# EAGLE design 3P4W_v1p3 (EAGLE 9.6.2)
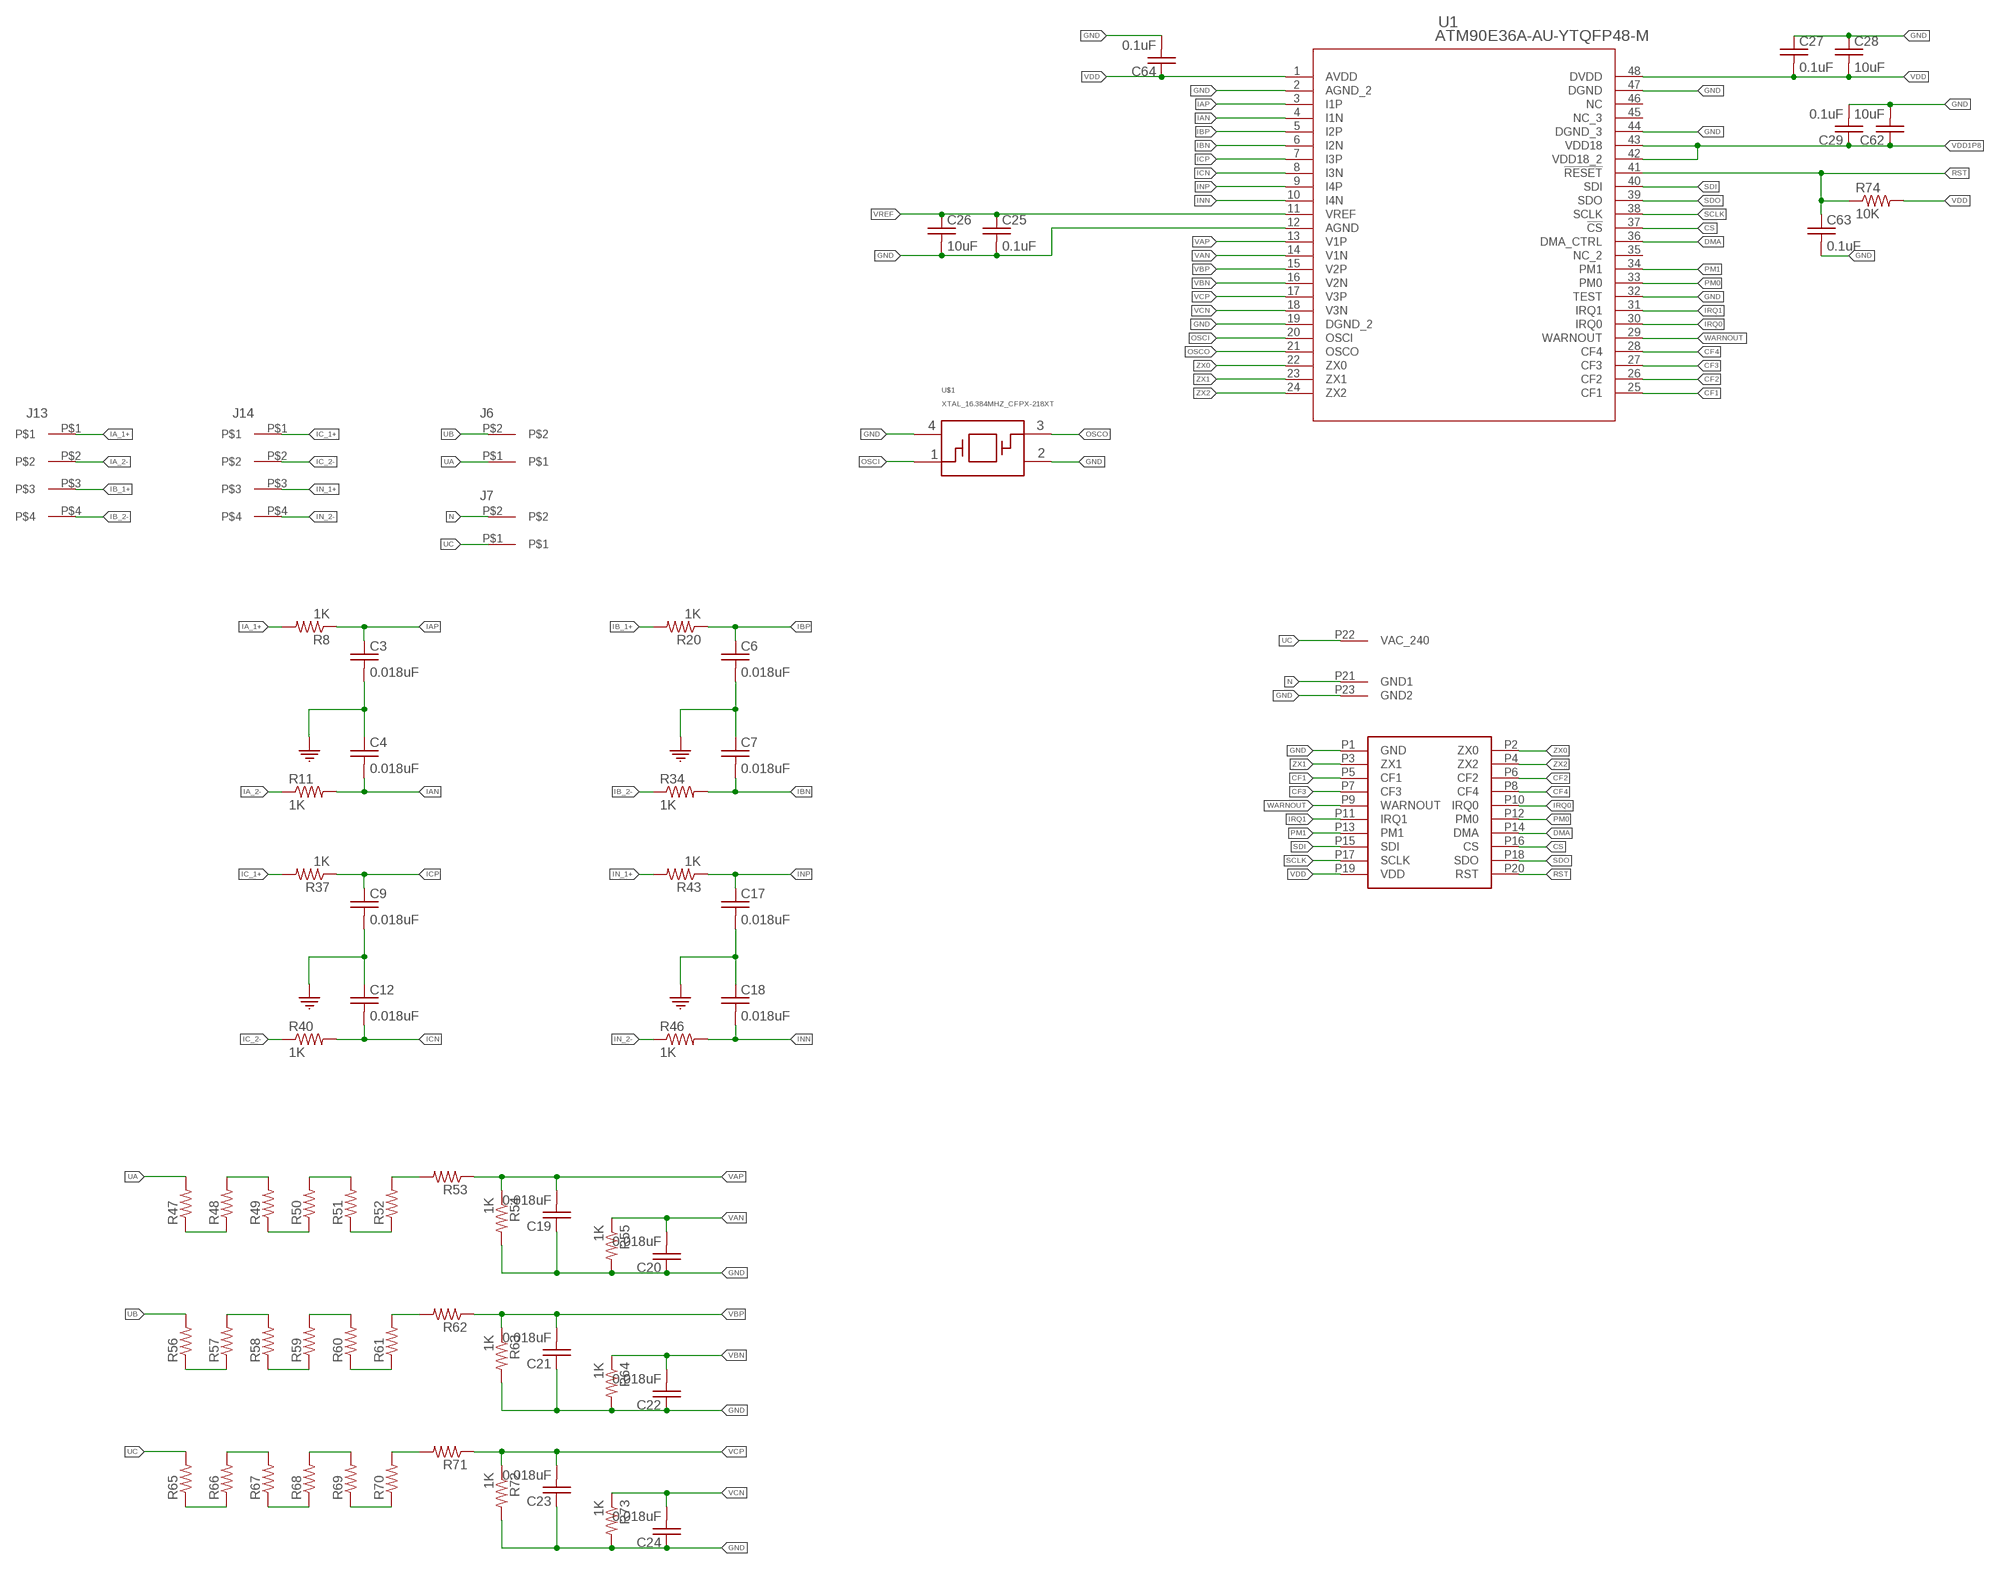
[diagram p0: schematic, sheet 1]

## Parts
C3  0.018uF  C_0402  [0402]
C4  0.018uF  C_0402  [0402]
C6  0.018uF  C_0402  [0402]
C7  0.018uF  C_0402  [0402]
C9  0.018uF  C_0402  [0402]
C12  0.018uF  C_0402  [0402]
C17  0.018uF  C_0402  [0402]
C18  0.018uF  C_0402  [0402]
C19  0.018uF  C_0402  [0402]
C20  0.018uF  C_0402  [0402]
C21  0.018uF  C_0402  [0402]
C22  0.018uF  C_0402  [0402]
C23  0.018uF  C_0402  [0402]
C24  0.018uF  C_0402  [0402]
C25  0.1uF  C_0402  [0402]
C26  10uF  C_0402  [0402]
C27  0.1uF  C_0402  [0402]
C28  10uF  C_0402  [0402]
C29  0.1uF  C_0402  [0402]
C62  10uF  C_0402  [0402]
C63  0.1uF  C_0402  [0402]
C64  0.1uF  C_0402  [0402]
J6  3.81MM_1_X_2_RT_ANGLE_PLUG_HEADER  [2_3.81MM_PITCH]
J7  3.81MM_1_X_2_RT_ANGLE_PLUG_HEADER  [2_3.81MM_PITCH]
J13  3.81MM_1_X_4_RT_ANGLE_PLUG_HEADER  [1X4_3.81MM_PITCH]
J14  3.81MM_1_X_4_RT_ANGLE_PLUG_HEADER  [1X4_3.81MM_PITCH]
R8  1K  R_0402  [0402]
R11  1K  R_0402  [0402]
R20  1K  R_0402  [0402]
R34  1K  R_0402  [0402]
R37  1K  R_0402  [0402]
R40  1K  R_0402  [0402]
R43  1K  R_0402  [0402]
R46  1K  R_0402  [0402]
R47  R_0402  [0402]
R48  R_0402  [0402]
R49  R_0402  [0402]
R50  R_0402  [0402]
R51  R_0402  [0402]
R52  R_0402  [0402]
R53  R_0402  [0402]
R54  1K  R_0402  [0402]
R55  1K  R_0402  [0402]
R56  R_0402  [0402]
R57  R_0402  [0402]
R58  R_0402  [0402]
R59  R_0402  [0402]
R60  R_0402  [0402]
R61  R_0402  [0402]
R62  R_0402  [0402]
R63  1K  R_0402  [0402]
R64  1K  R_0402  [0402]
R65  R_0402  [0402]
R66  R_0402  [0402]
R67  R_0402  [0402]
R68  R_0402  [0402]
R69  R_0402  [0402]
R70  R_0402  [0402]
R71  R_0402  [0402]
R72  1K  R_0402  [0402]
R73  1K  R_0402  [0402]
R74  10K  R_0402  [0402]
U1  ATM90E36A-AU-YTQFP48-M  [TQFP48-M]
U$1  XTAL_16.384MHZ_CFPX-218XT  [XTAL_2.5X2.0]
U$2  METER_BASE  [METER_BASE]

## Nets
CF1: U1.25(CF1) U$2.P5(CF1)
CF2: U1.26(CF2) U$2.P6(CF2)
CF3: U1.27(CF3) U$2.P7(CF3)
CF4: U1.28(CF4) U$2.P8(CF4)
CS: U1.37(!CS) U$2.P16(CS)
DMA: U1.36(DMA_CTRL) U$2.P14(DMA)
GND: C3.P$2 C4.P$1 C6.P$2 C7.P$1 C9.P$2 C12.P$1 C17.P$2 C18.P$1 C19.P$1 C20.P$1 C21.P$1 C22.P$1 C23.P$1 C24.P$1 C25.P$2 C26.P$2 C27.P$1 C28.P$1 C29.P$2 C62.P$2 C63.P$2 C64.P$2 R54.P$2 R55.P$2 R63.P$2 R64.P$2 R72.P$2 R73.P$2 U1.2(AGND_2) U1.12(AGND) U1.19(DGND_2) U1.32(TEST) U1.44(DGND_3) U1.47(DGND) U$1.2 U$1.4 U$2.P1(GND) U$2.P23(GND2)
IA_1+: J13.P$1 R8.P$2
IA_2-: J13.P$2 R11.P$1
IAN: C4.P$2 R11.P$2 U1.4(I1N)
IAP: C3.P$1 R8.P$1 U1.3(I1P)
IB_1+: J13.P$3 R20.P$2
IB_2-: J13.P$4 R34.P$1
IBN: C7.P$2 R34.P$2 U1.6(I2N)
IBP: C6.P$1 R20.P$1 U1.5(I2P)
IC_1+: J14.P$1 R37.P$2
IC_2-: J14.P$2 R40.P$1
ICN: C12.P$2 R40.P$2 U1.8(I3N)
ICP: C9.P$1 R37.P$1 U1.7(I3P)
IN_1+: J14.P$3 R43.P$2
IN_2-: J14.P$4 R46.P$1
INN: C18.P$2 R46.P$2 U1.10(I4N)
INP: C17.P$1 R43.P$1 U1.9(I4P)
IRQ0: U1.30(IRQ0) U$2.P10(IRQ0)
IRQ1: U1.31(IRQ1) U$2.P11(IRQ1)
N: J7.P$2 U$2.P21(GND1)
N$16: R56.P$1 R57.P$1
N$17: R47.P$1 R48.P$1
N$18: R48.P$2 R49.P$2
N$19: R49.P$1 R50.P$1
N$20: R50.P$2 R51.P$2
N$21: R51.P$1 R52.P$1
N$22: R52.P$2 R53.P$2
N$23: R57.P$2 R58.P$2
N$24: R58.P$1 R59.P$1
N$25: R59.P$2 R60.P$2
N$26: R60.P$1 R61.P$1
N$27: R61.P$2 R62.P$2
N$28: R65.P$1 R66.P$1
N$29: R66.P$2 R67.P$2
N$30: R67.P$1 R68.P$1
N$31: R68.P$2 R69.P$2
N$32: R69.P$1 R70.P$1
N$33: R70.P$2 R71.P$2
OSCI: U1.20(OSCI) U$1.1
OSCO: U1.21(OSCO) U$1.3
PM0: U1.33(PM0) U$2.P12(PM0)
PM1: U1.34(PM1) U$2.P13(PM1)
RST: C63.P$1 R74.P$1 U1.41(!RESET) U$2.P20(RST)
SCLK: U1.38(SCLK) U$2.P17(SCLK)
SDI: U1.40(SDI) U$2.P15(SDI)
SDO: U1.39(SDO) U$2.P18(SDO)
UA: J6.P$1 R47.P$2
UB: J6.P$2 R56.P$2
UC: J7.P$1 R65.P$2 U$2.P22(VAC_240)
VAN: C20.P$2 R55.P$1 U1.14(V1N)
VAP: C19.P$2 R53.P$1 R54.P$1 U1.13(V1P)
VBN: C22.P$2 R64.P$1 U1.16(V2N)
VBP: C21.P$2 R62.P$1 R63.P$1 U1.15(V2P)
VCN: C24.P$2 R73.P$1 U1.18(V3N)
VCP: C23.P$2 R71.P$1 R72.P$1 U1.17(V3P)
VDD: C27.P$2 C28.P$2 C64.P$1 R74.P$2 U1.1(AVDD) U1.48(DVDD) U$2.P19(VDD)
VDD1P8: C29.P$1 C62.P$1 U1.42(VDD18_2) U1.43(VDD18)
VREF: C25.P$1 C26.P$1 U1.11(VREF)
WARNOUT: U1.29(WARNOUT) U$2.P9(WARNOUT)
ZX0: U1.22(ZX0) U$2.P2(ZX0)
ZX1: U1.23(ZX1) U$2.P3(ZX1)
ZX2: U1.24(ZX2) U$2.P4(ZX2)
Unconnected: U1.35(NC_2) U1.45(NC_3) U1.46(NC)

## Library data of the parts
C3 C4 C6 C7 C9 C12 C17-C29 C62-C64 = 3D_MIG_Controller:C_0402
J6 J7 = 3D_MIG_Controller:3.81MM_1_X_2_RT_ANGLE_PLUG_HEADER
J13 J14 = 3D_MIG_Controller:3.81MM_1_X_4_RT_ANGLE_PLUG_HEADER
R8 R11 R20 R34 R37 R40 R43 R46-R74 = 3D_MIG_Controller:R_0402
U1 = 3D_MIG_Controller:ATM90E36A-AU-Y; MANUFACTURER_PART_NUMBER: ATM90E36AAUY; VENDOR: Atmel
U$1 = 3D_MIG_Controller:XTAL_16.384MHZ_CFPX-218
U$2 = 3D_MIG_Controller:METER_BASE

## Board
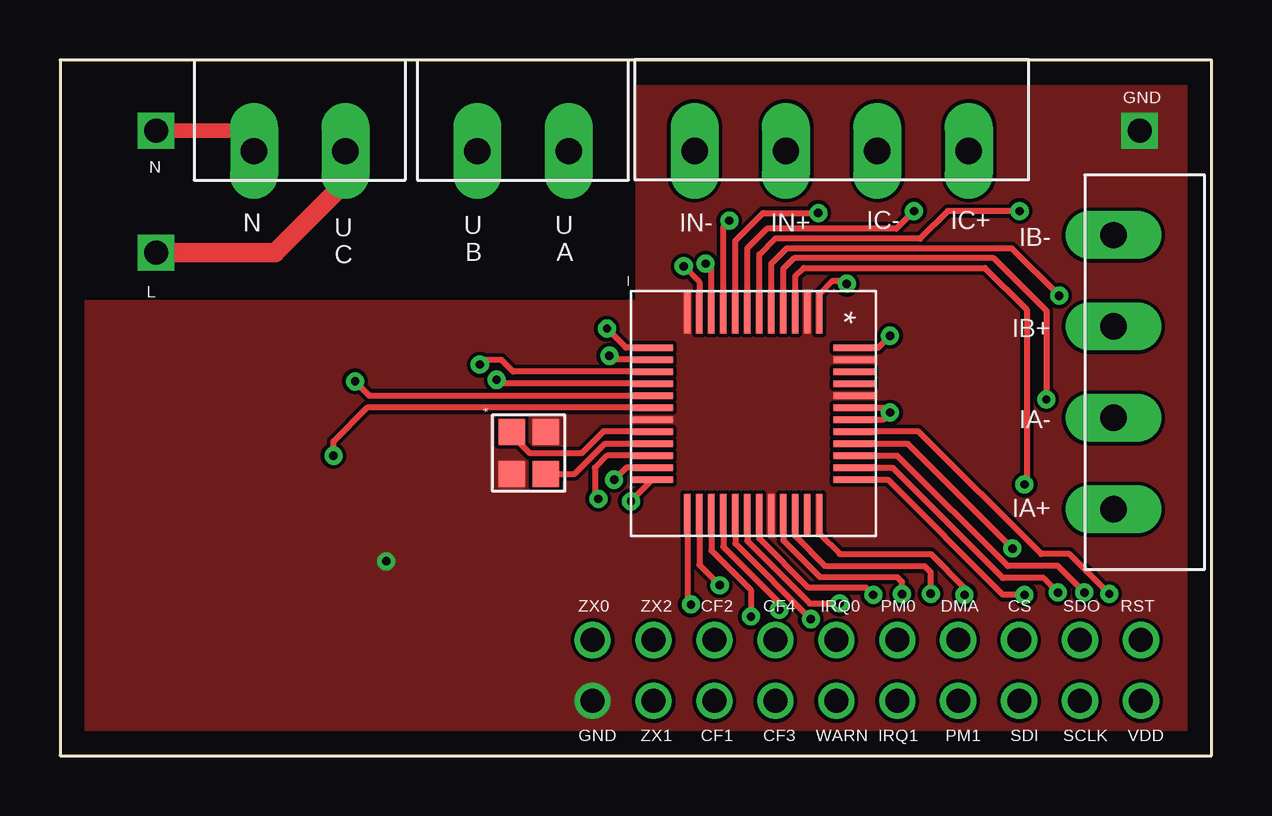
[diagram p1: board, top side]
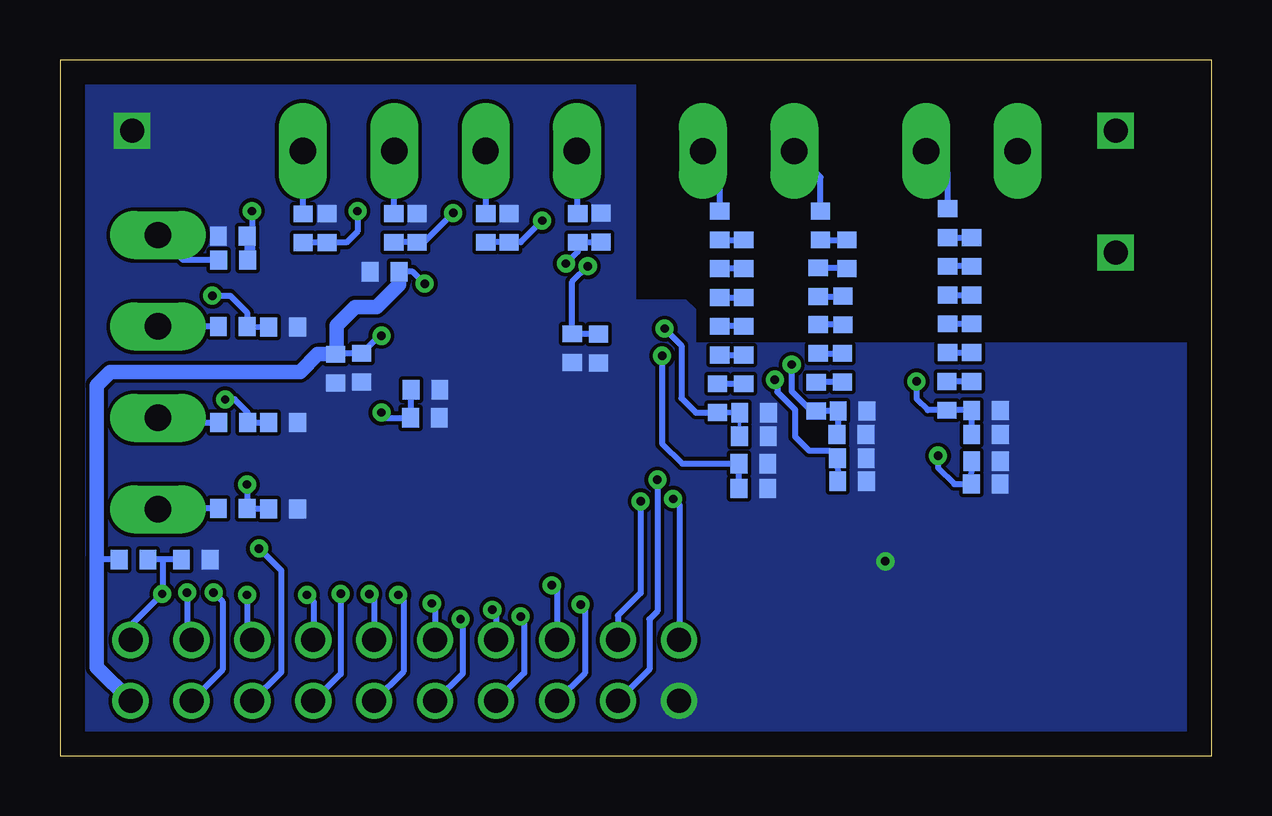
[diagram p2: board, bottom side, seen from below]

Size 48 x 29 mm. Coordinates in mm from the lower left corner, seen from the top.
Outline: 0,0 0,29 48,29 48,0 0,0
Copper layers (1*16): Top 0.035mm / dielectric 1.5mm / Bottom 0.035mm
Design rules "default": minimum track width 6mil, minimum drill 0.35mm, track to track 6mil, track to pad 6mil, pad to pad 6mil, via to via 6mil, smd to smd 6mil, copper to edge 40mil, drill to drill 6mil, minimum pad ring 10mil, minimum via ring 8mil, stop-mask expansion 4mil, vias tented up to drill 0mil, thermal gap 10mil

### Footprints (pad centres in the part's own frame; a part is rotated, then mirrored left to right if it is on the bottom)
0402 = smd 0.8 x 0.7: P$1 0,0.6; P$2 0,-0.6
2_3.81MM_PITCH = drill 1.1 pad 2 long: P$1 0,0; P$2 3.81,0
1X4_3.81MM_PITCH = drill 1.1 pad 2 long: P$1 0,0; P$2 3.81,0; P$3 7.62,0; P$4 11.43,0
TQFP48-M = smd 1.716 x 0.27: 1 -4.201,2.75; 2 -4.201,2.25; 3 -4.201,1.75; 4 -4.201,1.25; 5 -4.201,0.75; 6 -4.201,0.25; 7 -4.201,-0.25; 8 -4.201,-0.75; 9 -4.201,-1.25; 10 -4.201,-1.75; 11 -4.201,-2.25; 12 -4.201,-2.75; 25 4.201,-2.75; 26 4.201,-2.25; 27 4.201,-1.75; 28 4.201,-1.25; 29 4.201,-0.75; 30 4.201,-0.25; 31 4.201,0.25; 32 4.201,0.75; 33 4.201,1.25; 34 4.201,1.75; 35 4.201,2.25; 36 4.201,2.75 | smd 0.27 x 1.716: 13 -2.75,-4.201; 14 -2.25,-4.201; 15 -1.75,-4.201; 16 -1.25,-4.201; 17 -0.75,-4.201; 18 -0.25,-4.201; 19 0.25,-4.201; 20 0.75,-4.201; 21 1.25,-4.201; 22 1.75,-4.201; 23 2.25,-4.201; 24 2.75,-4.201; 37 2.75,4.201; 38 2.25,4.201; 39 1.75,4.201; 40 1.25,4.201; 41 0.75,4.201; 42 0.25,4.201; 43 -0.25,4.201; 44 -0.75,4.201; 45 -1.25,4.201; 46 -1.75,4.201; 47 -2.25,4.201; 48 -2.75,4.201
XTAL_2.5X2.0 = smd 1.1 x 1.1: 1 -0.875,-0.713; 2 0.875,-0.713; 3 0.875,0.713; 4 -0.875,0.713
METER_BASE = drill 1: P1 22.2,2.276; P2 22.2,4.816; P3 24.74,2.276; P4 24.74,4.816; P5 27.28,2.276; P6 27.28,4.816; P7 29.82,2.276; P8 29.82,4.816; P9 32.36,2.276; P10 32.36,4.816; P11 34.9,2.276; P12 34.9,4.816; P13 37.44,2.276; P14 37.44,4.816; P15 39.98,2.276; P16 39.98,4.816; P17 42.52,2.276; P18 42.52,4.816; P19 45.06,2.276; P20 45.06,4.816 | drill 1 square: P21 4,26.046; P22 4,20.966; P23 45,26.046

### Placement (x,y rotation side)
C3  38.7,10.28 90 bottom
C4  38.7,13.89 270 bottom
C6  38.7,17.87 90 bottom
C7  40.8,21.66 90 bottom
C9  36.86,21.99 180 bottom
C12  33.12,22 0 bottom
C17  29.28,22 180 bottom
C18  25.45,22.01 0 bottom
C19  19.08,13.31 270 bottom
C20  19.1,11.13 270 bottom
C21  14.96,14.37 270 bottom
C22  15,12.4 270 bottom
C23  9.4,13.38 270 bottom
C24  9.4,12.27 270 bottom
C25  25.55,16.97 0 bottom
C26  26.65,16.98 0 bottom
C27  34.47,20.17 90 bottom
C28  36.51,16.13 180 bottom
C29  32.79,14.08 90 bottom
C62  32.77,15.25 90 bottom
C63  42.34,8.17 90 bottom
C64  35.43,16.17 0 bottom
J6  21.2,25.2 180 top
J7  11.9,25.2 180 top
J13  43.91,10.27 90 top
J14  37.88,25.21 180 top
R8  40.8,10.3 270 bottom
R11  40.78,13.88 90 bottom
R20  40.8,17.89 270 bottom
R34  40.78,20.66 90 bottom
R37  37.86,21.98 180 bottom
R40  34.08,22 0 bottom
R43  30.25,22 180 bottom
R46  26.42,22 0 bottom
R47  20.5,22.1 180 bottom
R48  19.5,20.9 0 bottom
R49  20.5,19.7 180 bottom
R50  19.5,18.5 0 bottom
R51  20.5,17.3 180 bottom
R52  19.5,16.1 0 bottom
R53  20.6,14.9 180 bottom
R54  19.07,14.29 90 bottom
R55  19.1,12.17 90 bottom
R56  16.3,22.1 180 bottom
R57  15.2,20.9 0 bottom
R58  16.4,19.73 180 bottom
R59  15.36,18.56 0 bottom
R60  16.4,17.37 180 bottom
R61  15.39,16.17 0 bottom
R62  16.48,14.96 180 bottom
R63  15.01,13.39 90 bottom
R64  14.98,11.44 90 bottom
R65  11,22.2 180 bottom
R66  10,21 0 bottom
R67  11,19.8 180 bottom
R68  10,18.6 0 bottom
R69  11,17.4 180 bottom
R70  10,16.2 0 bottom
R71  11.03,15 180 bottom
R72  9.4,14.39 90 bottom
R73  9.41,11.32 90 bottom
R74  44.93,8.17 270 bottom
U1  28.9,14.26 270 top
U$1  19.54,12.62 270 top
U$2  0,0 0 top

### Tracks (layer width: path | path; a pad name or v marks a point on that pad's centre or on a via)
CF1  (via drill 0.35)
  Top 0.254: U1.25 26.15,6.45 v26.3,6.3
  Bottom 0.254: U$2.P5 26.12,3.44 26.12,6.12 v26.3,6.3
CF2  (via drill 0.35)
  Top 0.254: U1.26 26.65,7.95 v27.5,7.1
  Bottom 0.254: v27.5,7.1 27.28,6.88 U$2.P6
CF3  (via drill 0.35)
  Top 0.254: U1.27 27.15,8.55 28.8,6.9 v28.8,5.8
  Bottom 0.254: v28.8,5.8 28.65,5.65 28.65,3.45 U$2.P7
CF4  (via drill 0.35)
  Top 0.254: U1.28 27.65,8.71 29.98,6.38 v29.98,6.08
  Bottom 0.254: v29.98,6.08 29.82,5.92 U$2.P8
CS  (via drill 0.35)
  Top 0.254: U1.37 34.5,11.51 39.31,6.7 v40.2,6.7
  Bottom 0.254: v40.2,6.7 40.2,4.82 U$2.P16
DMA  (via drill 0.35)
  Top 0.254: U1.36 31.65,9.25 32.5,8.4 36.3,8.4 37.7,7 v37.7,6.7
  Bottom 0.254: U$2.P14 37.43,6.43 v37.7,6.7
GND  (via drill 0.35)
  other vias: 13.6,8.1
  pour Bottom (no thermals): 0,17.2 21.5,17.2 21.5,18.6 21.9,19 24,19 24,29 48,29 48,0 0,0
  pour Top (no thermals): 0,19 24.01,19 24.01,29 48,29 48,0 0,0
IA_1+
  Bottom 0.254: R8.P$2 43.88,10.3 J13.P$1
IA_2-
  Bottom 0.254: J13.P$2 43.71,13.88 R11.P$1
IAN  (via drill 0.35)
  Top 0.254: U1.4 30.15,20.3 30.59,20.74 38.92,20.74 41.12,18.55 v41.12,14.85
  Bottom 0.254: v41.12,14.85 40.72,14.85 40.18,14.31 R11.P$2 39.5,13.88 39.49,13.89 C4.P$2
IAP  (via drill 0.35)
  Top 0.254: U1.3 30.65,19.98 31,20.33 38.55,20.33 40.3,18.59 40.3,11.4 v40.2,11.3
  Bottom 0.254: v40.2,11.3 R8.P$1 40.17,10.28 C3.P$1
IB_1+
  Bottom 0.254: R20.P$2 J13.P$3
IB_2-
  Bottom 0.254: R34.P$1 42.87,20.66 J13.P$4
IBN  (via drill 0.35)
  Top 0.254: U1.6 29.15,20.89 29.81,21.55 35.85,21.55 37,22.7 v40,22.7
  Bottom 0.254: v40,22.7 40,20.84 R34.P$2 40.18,21.64 C7.P$2
IBP  (via drill 0.35)
  Top 0.254: U1.5 29.65,20.51 30.28,21.14 39.68,21.14 v41.65,19.17
  Bottom 0.254: v41.65,19.17 40.9,19.17 40.2,18.47 R20.P$1 C6.P$1
IC_1+
  Bottom 0.254: R37.P$2 37.86,25.19 J14.P$1
IC_2-
  Bottom 0.254: R40.P$1 J14.P$2
ICN  (via drill 0.35)
  Top 0.254: U1.8 28.15,21.46 29.31,22.62 v31.61,22.62
  Bottom 0.254: v31.61,22.62 32.83,21.4 C12.P$2 R40.P$2
ICP  (via drill 0.35)
  Top 0.254: U1.7 28.65,21.15 29.46,21.96 34.86,21.96 v35.6,22.7
  Bottom 0.254: v35.6,22.7 35.6,21.85 36.06,21.39 C9.P$1 R37.P$1
IN_1+
  Bottom 0.254: R43.P$2 J14.P$3
IN_2-
  Bottom 0.254: R46.P$1 26.42,25.18 J14.P$4
INN  (via drill 0.35)
  Top 0.254: U1.10 27.15,20.27 v26.91,20.51
  Bottom 0.254: v26.91,20.51 v26.91,20.52 26.42,21.01 R46.P$2 C18.P$2
INP  (via drill 0.35)
  Top 0.254: U1.9 27.65,22.05 v27.9,22.3
  Bottom 0.254: v27.9,22.3 28.8,21.4 C17.P$1 R43.P$1
IRQ0  (via drill 0.35)
  Top 0.254: U1.30 28.65,8.95 31.26,6.34 v32.5,6.34
  Bottom 0.254: v32.5,6.34 32.36,6.2 U$2.P10
IRQ1  (via drill 0.35)
  Top 0.254: v33.9,6.7 33.6,7 31.2,7 29.15,9.05 U1.31
  Bottom 0.254: U$2.P11 33.68,3.5 33.68,6.48 v33.9,6.7
N
  Top 0.61: J7.P$2 7.24,26.05 U$2.P21
N$16
  Bottom 0.254: R56.P$1 R57.P$1
N$17
  Bottom 0.254: R47.P$1 R48.P$1
N$18
  Bottom 0.254: R48.P$2 R49.P$2
N$19
  Bottom 0.254: R49.P$1 R50.P$1
N$20
  Bottom 0.254: R50.P$2 R51.P$2
N$21
  Bottom 0.254: R51.P$1 R52.P$1
N$22
  Bottom 0.254: R52.P$2 R53.P$2
N$23
  Bottom 0.254: R57.P$2 15.23,20.33 R58.P$2
N$24
  Bottom 0.254: R58.P$1 15.39,19.13 R59.P$1
N$25
  Bottom 0.254: R59.P$2 R60.P$2
N$26
  Bottom 0.254: R60.P$1 R61.P$1
N$27
  Bottom 0.254: R61.P$2 R62.P$2
N$28
  Bottom 0.254: R65.P$1 R66.P$1
N$29
  Bottom 0.254: R66.P$2 R67.P$2
N$30
  Bottom 0.254: R67.P$1 R68.P$1
N$31
  Bottom 0.254: R68.P$2 R69.P$2
N$32
  Bottom 0.254: R69.P$1 R70.P$1
N$33
  Bottom 0.254: R70.P$2 R71.P$2
OSCI
  Top 0.254: U1.20 22.65,13.51 21.74,12.6 19.6,12.6 18.83,13.37 U$1.1
OSCO
  Top 0.254: U$1.3 21.45,11.74 22.72,13.01 U1.21
PM0  (via drill 0.35)
  Top 0.254: U1.33 30.15,8.97 31.69,7.44 34.9,7.44 35.1,7.24 v35.1,6.74
  Bottom 0.254: v35.1,6.74 34.9,6.54 U$2.P12
PM1  (via drill 0.35)
  Top 0.254: U1.34 30.65,9.15 31.91,7.89 36.05,7.89 36.3,7.64 v36.3,6.74
  Bottom 0.254: v36.3,6.74 36.3,3.4 37.42,2.28 U$2.P13
RST  (via drill 0.35)
  Top 0.254: v43.74,6.74 42.08,8.4 40.9,8.4 35.79,13.51 U1.41
  Bottom 0.254: U$2.P20 45.06,5.42 v43.74,6.74 43.7,6.78 43.7,8.17 | C63.P$1 43.7,8.17 | 43.7,8.17 R74.P$1
SCLK  (via drill 0.35)
  Top 0.254: U1.38 34.69,12.01 39.3,7.4 41,7.4 v41.6,6.8
  Bottom 0.254: U$2.P17 41.22,3.58 41.22,6.42 v41.6,6.8
SDI  (via drill 0.35)
  Top 0.254: v39.7,8.63 35.32,13.01 U1.40
  Bottom 0.254: v39.7,8.63 38.78,7.71 38.78,3.48 U$2.P15
SDO  (via drill 0.35)
  Top 0.254: U1.39 34.89,12.51 39.5,7.9 41.6,7.9 v42.7,6.8
  Bottom 0.254: v42.7,6.8 v42.69,6.79 42.69,4.99 U$2.P18
UA
  Bottom 0.254: R47.P$2 20.5,24.5 J6.P$1
UB
  Bottom 0.254: R56.P$2 16.3,24.11 J6.P$2
UC
  Top 0.813: J7.P$1 11.9,23.9 8.97,20.97 U$2.P22
  Bottom 0.254: R65.P$2 11,24.3 J7.P$1
VAN  (via drill 0.35)
  Top 0.254: U1.14 23.06,16.51 v22.9,16.67
  Bottom 0.254: v22.9,16.67 22.9,13 22.07,12.17 R55.P$1 C20.P$2
VAP  (via drill 0.35)
  Top 0.254: U1.13 23.59,17.01 v22.8,17.8
  Bottom 0.152: C19.P$2 R54.P$1
  Bottom 0.254: R54.P$1 20.3,14.3 R53.P$1 21.5,14.3 22.1,14.9 22.1,17.1 v22.8,17.8
VBN  (via drill 0.35)
  Top 0.254: U1.16 18.36,15.51 v18.2,15.67
  Bottom 0.254: R64.P$1 C22.P$2 15.91,12.71 16.78,12.71 17.36,13.29 17.36,14.43 18.1,15.16 18.1,15.57 v18.2,15.67
VBP  (via drill 0.35)
  Top 0.254: U1.15 18.89,16.01 18.4,16.5 17.7,16.5 v17.5,16.3
  Bottom 0.254: R63.P$1 15.56,13.44 C21.P$2 R62.P$1 16.68,14.36 17.5,15.18 v17.5,16.3
VCN  (via drill 0.35)
  Top 0.254: U1.18 12.81,14.51 11.4,13.1 v11.4,12.5
  Bottom 0.254: v11.4,12.5 11.4,12 10.72,11.32 R73.P$1 C24.P$2
VCP  (via drill 0.35)
  Top 0.254: v12.3,15.6 12.89,15.01 U1.17
  Bottom 0.254: C23.P$2 R72.P$1 R71.P$1 11.83,14.4 12.3,14.87 v12.3,15.6
VDD  (via drill 0.35)
  Top 0.254: U1.1 31.65,19.25 32.2,19.8 32.67,19.8 v32.8,19.67 | U1.48 34.11,17.01 v34.6,17.5
  Bottom 0.254: v32.8,19.67 33.3,20.17 C27.P$2 | v34.6,17.5 34.7,17.5 C64.P$1 36.47,16.77 C28.P$2 | R74.P$2 46.44,8.17 46.47,8.2
  Bottom 0.61: C27.P$2 33.87,19.63 34.8,18.7 35.7,18.7 36.47,17.93 36.47,16.77 | C28.P$2 37.27,16.73 38,16 45.9,16 46.47,15.43 46.47,8.2 46.47,3.69 U$2.P19
VDD1P8  (via drill 0.35)
  Top 0.254: U1.42 34.31,14.01 v34.6,14.3 34.39,14.51 U1.43
  Bottom 0.254: v34.6,14.3 34.38,14.08 C29.P$1 33.37,14.1 C62.P$1
VREF  (via drill 0.35)
  Top 0.254: v26,20.4 26.65,19.75 U1.11
  Bottom 0.254: C25.P$1 26.64,17.57 C26.P$1 26.65,19.75 v26,20.4
WARNOUT  (via drill 0.35)
  Top 0.254: U1.29 28.15,8.84 v31.3,5.68
  Bottom 0.254: U$2.P9 31.21,3.42 31.21,5.59 v31.3,5.68
ZX0  (via drill 0.35)
  Top 0.254: U1.22 22.81,12.51 22.3,12 22.3,10.84 v22.44,10.7
  Bottom 0.254: v22.44,10.7 22.17,10.43 22.17,4.84 U$2.P2
ZX1  (via drill 0.35)
  Top 0.254: U1.23 23.61,12.01 v23.1,11.5
  Bottom 0.254: U$2.P3 23.43,3.59 23.43,5.69 23.1,6.02 v23.1,11.5
ZX2  (via drill 0.35)
  Top 0.254: U1.24 v23.8,10.61 v23.8,10.6
  Bottom 0.254: v23.8,10.6 23.8,6.78 24.74,5.83 U$2.P4

### Text on the board
tPlace: GND | N | N | IN- | IN+ | IC- | IC+ | U / C | U / B | U / A | IB- | L | IB+ | IA- | IA+ | ZX0 | ZX2 | CF2 | CF4 | IRQ0 | PM0 | DMA | CS | SDO | RST | GND | ZX1 | CF1 | CF3 | WARN | IRQ1 | PM1 | SDI | SCLK | VDD